# Altium schematic sheet lpc11c14.SchDoc
size A4
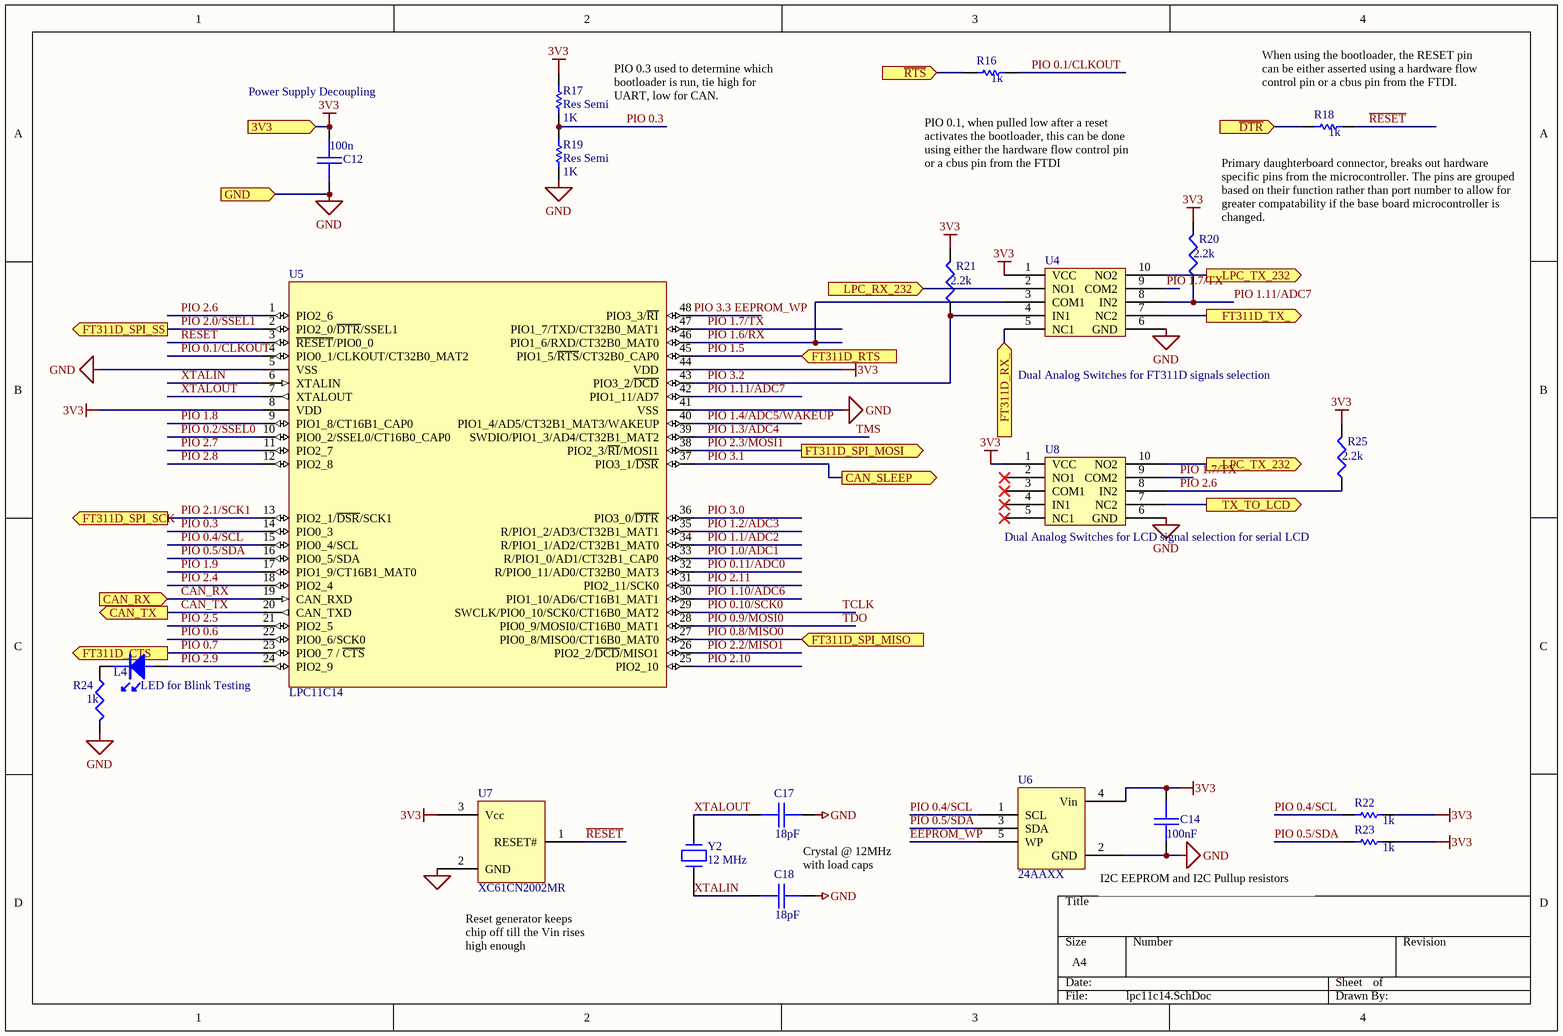
[diagram p0: lpc11c14.SchDoc]

## Parts
C12  value 100n  [0603]  (hidden comment: CAP)
C14  value 100nF  [0603]  (hidden comment: CAP)
C17  value 18pF  [0603]  (hidden comment: CAP)
C18  value 18pF  [0603]  (hidden comment: CAP)
L4  LED for Blink Testing  [0805LED]
R16  value 1k  [0603]  (hidden comment: Res Semi)
R17  Res Semi  value 1K  [0603]
R18  value 1k  [0603]  (hidden comment: Res Semi)
R19  Res Semi  value 1K  [0603]
R20  value 2.2k  [0603]  (hidden comment: RES1)
R21  value 2.2k  [0603]  (hidden comment: RES1)
R22  value 1k  [0603]  (hidden comment: Res Semi)
R23  value 1k  [0603]  (hidden comment: Res Semi)
R24  value 1k  [0603]  (hidden comment: RES1)
R25  value 2.2k  [0603]  (hidden comment: RES1)
U4  Dual Analog Switches for FT311D signals selection  [Micro10]
U5  LPC11C14  [QFP48]
U6  24AAXX  [SOT23-5]
U7  XC61CN2002MR  [SOT23-3]
U8  Dual Analog Switches for LCD signal selection for serial LCD  [Micro10]
Y2  12 MHz  [HC49/4H]

## Ports
3V3 (in), CAN_RX (in), CAN_SLEEP (out), CAN_TX (out), FT311D_CTS (out), FT311D_RTS (in), FT311D_RX_ (in), FT311D_SPI_MISO (in), FT311D_SPI_MOSI (out), FT311D_SPI_SCK (out), FT311D_SPI_SS (out), FT311D_TX_ (out), GND (in), LPC_RX_232 (in), LPC_TX_232 (out), TX_TO_LCD (out), ~{DTR} (in), ~{RTS} (in)

## Nets
3V3: C12.1 C14.1 R17.2 R20.2 R21.2 R22.2 R23.2 R25.2 U4.1(VCC) U5.8(VDD) U5.44(VDD) U6.4(Vin) U7.3(Vcc) U8.1(VCC) ; port 3V3
GND: C12.2 C14.2 C17.2 C18.2 R19.1 R24.2 U4.6(GND) U5.5(VSS) U5.41(VSS) U6.2(GND) U7.2(GND) U8.6(GND) ; port GND
~{DTR}: R18.1 ; port ~{DTR}
~{RTS}: R16.1 ; port ~{RTS}
CAN_RX: U5.19(CAN_RXD) ; port CAN_RX
CAN_TX: U5.20(CAN_TXD) ; port CAN_TX
EEPROM_WP: U5.48(PIO3_3/~{RI}) U6.5(WP)  [also labelled PIO 3.3]
FT311D_RX_: U4.5(NC1) ; port FT311D_RX_
FT311D_TX_: U4.7(NC2) ; port FT311D_TX_
LPC_RX_232: U4.2(NO1) ; port LPC_RX_232
LPC_TX_232: U4.10(NO2) U8.10(NO2) ; port LPC_TX_232
PIO 0.1/CLKOUT: R16.2 U5.4(PIO0_1/CLKOUT/CT32B0_MAT2)
PIO 0.2/SSEL0: U5.10(PIO0_2/SSEL0/CT16B0_CAP0)
PIO 0.3: R17.1 R19.2 U5.14(PIO0_3)
PIO 0.4/SCL: R22.1 U5.15(PIO0_4/SCL) U6.1(SCL)
PIO 0.5/SDA: R23.1 U5.16(PIO0_5/SDA) U6.3(SDA)
PIO 0.6: U5.22(PIO0_6/SCK0)
PIO 0.7: U5.23(PIO0_7_/_~{CTS}) ; port FT311D_CTS
PIO 0.8/MISO0: U5.27(PIO0_8/MISO0/CT16B0_MAT0) ; port FT311D_SPI_MISO
PIO 0.9/MOSI0: U5.28(PIO0_9/MOSI0/CT16B0_MAT1)  [also labelled TDO]
PIO 0.10/SCK0: U5.29(SWCLK/PIO0_10/SCK0/CT16B0_MAT2)  [also labelled TCLK]
PIO 0.11/ADC0: U5.32(R/PIO0_11/AD0/CT32B0_MAT3)
PIO 1.0/ADC1: U5.33(R/PIO1_0/AD1/CT32B1_CAP0)
PIO 1.1/ADC2: U5.34(R/PIO1_1/AD2/CT32B1_MAT0)
PIO 1.2/ADC3: U5.35(R/PIO1_2/AD3/CT32B1_MAT1)
PIO 1.3/ADC4: U5.39(SWDIO/PIO1_3/AD4/CT32B1_MAT2)  [also labelled TMS]
PIO 1.4/ADC5/WAKEUP: U5.40(PIO1_4/AD5/CT32B1_MAT3/WAKEUP)
PIO 1.5: U5.45(PIO1_5/~{RTS}/CT32B0_CAP0) ; port FT311D_RTS
PIO 1.6/RX: U4.3(COM1) U5.46(PIO1_6/RXD/CT32B0_MAT0)
PIO 1.7/TX: U4.9(COM2) U5.47(PIO1_7/TXD/CT32B0_MAT1) U8.9(COM2)
PIO 1.8: U5.9(PIO1_8/CT16B1_CAP0)
PIO 1.9: U5.17(PIO1_9/CT16B1_MAT0)
PIO 1.10/ADC6: U5.30(PIO1_10/AD6/CT16B1_MAT1)
PIO 1.11/ADC7: R20.1 U4.8(IN2) U5.42(PIO1_11/AD7)
PIO 2.0/SSEL1: U5.2(PIO2_0/~{DTR}/SSEL1) ; port FT311D_SPI_SS
PIO 2.1/SCK1: U5.13(PIO2_1/~{DSR}/SCK1) ; port FT311D_SPI_SCK
PIO 2.2/MISO1: U5.26(PIO2_2/~{DCD}/MISO1)
PIO 2.3/MOSI1: U5.38(PIO2_3/~{RI}/MOSI1) ; port FT311D_SPI_MOSI
PIO 2.4: U5.18(PIO2_4)
PIO 2.5: U5.21(PIO2_5)
PIO 2.6: R25.1 U5.1(PIO2_6) U8.8(IN2)
PIO 2.7: U5.11(PIO2_7)
PIO 2.8: U5.12(PIO2_8)
PIO 2.9: L4.A U5.24(PIO2_9)
PIO 2.10: U5.25(PIO2_10)
PIO 2.11: U5.31(PIO2_11/SCK0)
PIO 3.0: U5.36(PIO3_0/~{DTR})
PIO 3.1: U5.37(PIO3_1/~{DSR}) ; port CAN_SLEEP
PIO 3.2: R21.1 U4.4(IN1) U5.43(PIO3_2/~{DCD})
~{RESET}: R18.2 U5.3(~{RESET}/PIO0_0) U7.1(RESET#)
TX_TO_LCD: U8.7(NC2) ; port TX_TO_LCD
XTALIN: C18.1 U5.6(XTALIN) Y2.1
XTALOUT: C17.1 U5.7(XTALOUT) Y2.2
NetL4_K: L4.K R24.1

Not connected (* = marked no-connect by the designer): U8 2(NO1)* 3(COM1)* 4(IN1)* 5(NC1)*

## Notes on the sheet
- (near C12) Power Supply Decoupling
- PIO 0.3 used to determine which bootloader is run, tie high for UART, low for CAN.
- (near R18) When using the bootloader, the RESET pin can be either asserted using a hardware flow control pin or a cbus pin from the FTDI.
- Text
- (near R16) PIO 0.1, when pulled low after a reset activates the bootloader, this can be done using either the hardware flow control pin or a cbus pin from the FTDI
- Primary daughterboard connector, breaks out hardware specific pins from the microcontroller. The pins are grouped based on their function rather than port number to allow for greater compatability if the base board microcontroller is changed.
- Crystal @ 12MHz with load caps
- I2C EEPROM and I2C Pullup resistors
- (near U7) Reset generator keeps chip off till the Vin rises high enough

## Library data of the parts
C12 C14 C17 C18 = CAP: Capacitor
L4 = LED
R16-R19 R22 R23 = Res Semi: Semiconductor Resistor; Published: 8-Jun-2000; LatestRevisionDate: 17-Jul-2002; LatestRevisionNote: Re-released for DXP Platform.; PackageReference: AXIAL-0.5; Publisher: Altium Limited; PackageDescription: Axial Device, Thru-Hole; 2 Leads; 0.5 in Pin Spacing
R20 R21 R24 R25 = RES1: Resistor
U4 U8 = NLAS4684: Ultra-low resistance dual SPDT Analog switch
U5 = LPC11C14_Full: NXP LPC11C14 Microcontroller; Farnell: NA
U6 = 24AAXX: I2C EEPROM for SOT23-5 package
U7 = XC61F: SOT23 reset generator; Needed?: Farnell; Farnell: 3605486; Farnell Price: 1.74
Y2 = CRYSTAL: Needed?: RS; RS: 693-8803; RS Price: 0.95